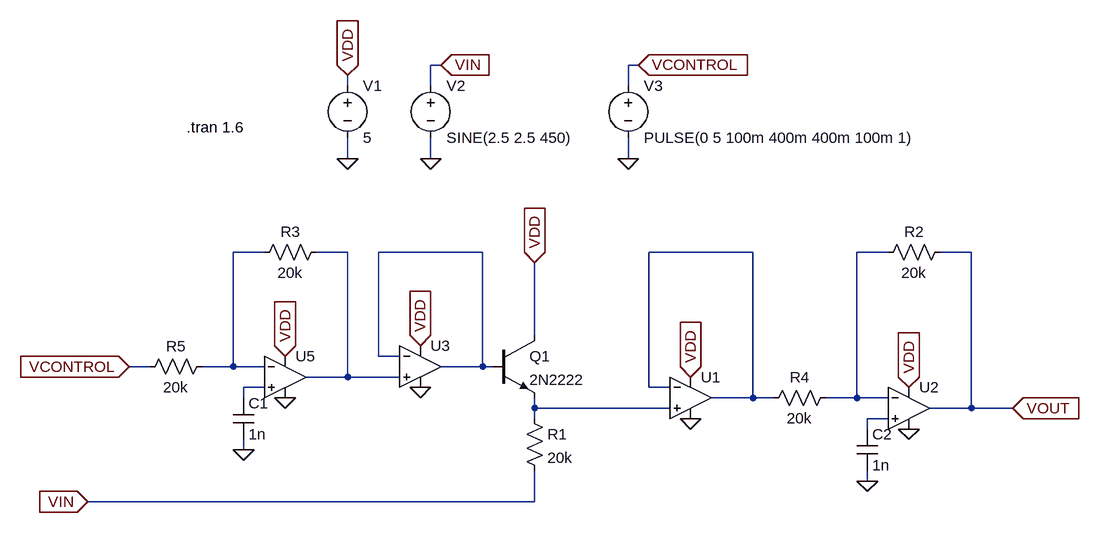
[diagram p0: schematic VCA.asc]
VCA.asc, the LTspice schematic file:
Version 4
SHEET 1 2068 936
WIRE 384 -528 368 -528
WIRE 688 -528 672 -528
WIRE 240 -496 240 -512
WIRE 368 -496 368 -528
WIRE 672 -496 672 -528
WIRE 240 -384 240 -416
WIRE 368 -384 368 -416
WIRE 672 -384 672 -416
WIRE 112 -240 64 -240
WIRE 240 -240 192 -240
WIRE 448 -240 288 -240
WIRE 864 -240 704 -240
WIRE 1072 -240 1024 -240
WIRE 1200 -240 1152 -240
WIRE 528 -112 528 -224
WIRE 288 -80 288 -240
WIRE 320 -80 288 -80
WIRE -64 -64 -96 -64
WIRE 64 -64 64 -240
WIRE 64 -64 16 -64
WIRE 112 -64 64 -64
WIRE 448 -64 448 -240
WIRE 448 -64 384 -64
WIRE 464 -64 448 -64
WIRE 240 -48 240 -240
WIRE 240 -48 176 -48
WIRE 320 -48 240 -48
WIRE 112 -32 80 -32
WIRE 704 -32 704 -240
WIRE 736 -32 704 -32
WIRE 80 -16 80 -32
WIRE 864 -16 864 -240
WIRE 864 -16 800 -16
WIRE 896 -16 864 -16
WIRE 1024 -16 1024 -240
WIRE 1024 -16 976 -16
WIRE 1072 -16 1024 -16
WIRE 528 0 528 -16
WIRE 736 0 528 0
WIRE 1200 0 1200 -240
WIRE 1200 0 1136 0
WIRE 1264 0 1200 0
WIRE 528 16 528 0
WIRE 1072 16 1040 16
WIRE 1040 32 1040 16
WIRE 80 64 80 48
WIRE 1040 112 1040 96
WIRE 528 144 528 96
WIRE 528 144 -160 144
FLAG 672 -384 0
FLAG 384 -528 VIN
IOPIN 384 -528 In
FLAG -96 -64 VCONTROL
IOPIN -96 -64 In
FLAG 368 -384 0
FLAG 352 -96 VDD
IOPIN 352 -96 In
FLAG 352 -32 0
FLAG 240 -512 VDD
IOPIN 240 -512 In
FLAG 240 -384 0
FLAG 528 -224 VDD
IOPIN 528 -224 In
FLAG -160 144 VIN
IOPIN -160 144 In
FLAG 144 -80 VDD
IOPIN 144 -80 In
FLAG 144 -16 0
FLAG 80 64 0
FLAG 688 -528 VCONTROL
IOPIN 688 -528 In
FLAG 768 -48 VDD
IOPIN 768 -48 In
FLAG 768 16 0
FLAG 1104 -32 VDD
IOPIN 1104 -32 In
FLAG 1104 32 0
FLAG 1040 112 0
FLAG 1264 0 VOUT
IOPIN 1264 0 In
SYMBOL voltage 672 -512 R0
WINDOW 123 0 0 Left 0
WINDOW 39 0 0 Left 0
SYMATTR InstName V3
SYMATTR Value PULSE(0 5 100m 400m 400m 100m 1)
SYMBOL voltage 368 -512 R0
WINDOW 123 0 0 Left 0
WINDOW 39 0 0 Left 0
SYMATTR InstName V2
SYMATTR Value SINE(2.5 2.5 450)
SYMBOL voltage 240 -512 R0
WINDOW 123 0 0 Left 0
WINDOW 39 0 0 Left 0
SYMATTR InstName V1
SYMATTR Value 5
SYMBOL res 208 -256 R90
WINDOW 0 0 56 VBottom 2
WINDOW 3 32 56 VTop 2
SYMATTR InstName R3
SYMATTR Value 20k
SYMBOL res 992 -32 R90
WINDOW 0 0 56 VBottom 2
WINDOW 3 32 56 VTop 2
SYMATTR InstName R4
SYMATTR Value 20k
SYMBOL cap 64 -16 R0
SYMATTR InstName C1
SYMATTR Value 1n
SYMBOL res 512 0 R0
SYMATTR InstName R1
SYMATTR Value 20k
SYMBOL npn 464 -112 R0
SYMATTR InstName Q1
SYMATTR Value 2N2222
SYMBOL OpAmps\\UniversalOpAmp2 768 -16 R0
SYMATTR InstName U1
SYMBOL OpAmps\\UniversalOpAmp2 352 -64 R0
SYMATTR InstName U3
SYMBOL OpAmps\\UniversalOpAmp2 144 -48 R0
SYMATTR InstName U5
SYMBOL res 1168 -256 R90
WINDOW 0 0 56 VBottom 2
WINDOW 3 32 56 VTop 2
SYMATTR InstName R2
SYMATTR Value 20k
SYMBOL cap 1024 32 R0
SYMATTR InstName C2
SYMATTR Value 1n
SYMBOL OpAmps\\UniversalOpAmp2 1104 0 R0
SYMATTR InstName U2
SYMBOL res 32 -80 R90
WINDOW 0 0 56 VBottom 2
WINDOW 3 32 56 VTop 2
SYMATTR InstName R5
SYMATTR Value 20k
TEXT -8 -432 Left 2 !.tran 1.6

The netlist it stands for:
* VCA.asc
V3 VCONTROL 0 PULSE(0 5 100m 400m 400m 100m 1)
V2 VIN 0 SINE(2.5 2.5 450)
V1 VDD 0 5
R3 N002 N001 20k
R4 N005 N004 20k
C1 N006 0 1n
R1 N007 VIN 20k
Q1 VDD N003 N007 0 2N2222
XU1 N007 N004 VDD 0 N004 level2 Avol=1Meg GBW=10Meg Slew=10Meg Ilimit=25m Rail=0 Vos=0 En=0 Enk=0 In=0 Ink=0 Rin=500Meg  ; pins In+ In- V+ V- OUT
XU3 N002 N003 VDD 0 N003 level2 Avol=1Meg GBW=10Meg Slew=10Meg Ilimit=25m Rail=0 Vos=0 En=0 Enk=0 In=0 Ink=0 Rin=500Meg  ; pins In+ In- V+ V- OUT
XU5 N006 N001 VDD 0 N002 level2 Avol=1Meg GBW=10Meg Slew=10Meg Ilimit=25m Rail=0 Vos=0 En=0 Enk=0 In=0 Ink=0 Rin=500Meg  ; pins In+ In- V+ V- OUT
R2 VOUT N005 20k
C2 N008 0 1n
XU2 N008 N005 VDD 0 VOUT level2 Avol=1Meg GBW=10Meg Slew=10Meg Ilimit=25m Rail=0 Vos=0 En=0 Enk=0 In=0 Ink=0 Rin=500Meg  ; pins In+ In- V+ V- OUT
R5 N001 VCONTROL 20k
.model NPN NPN
.model PNP PNP
.lib standard.bjt
.tran 1.6
.lib UniversalOpAmp2.lib
.backanno
.end